# Altium schematic sheet DDR3L_Module.SchDoc
size A4; SheetNumber: 7; SheetTotal: 8
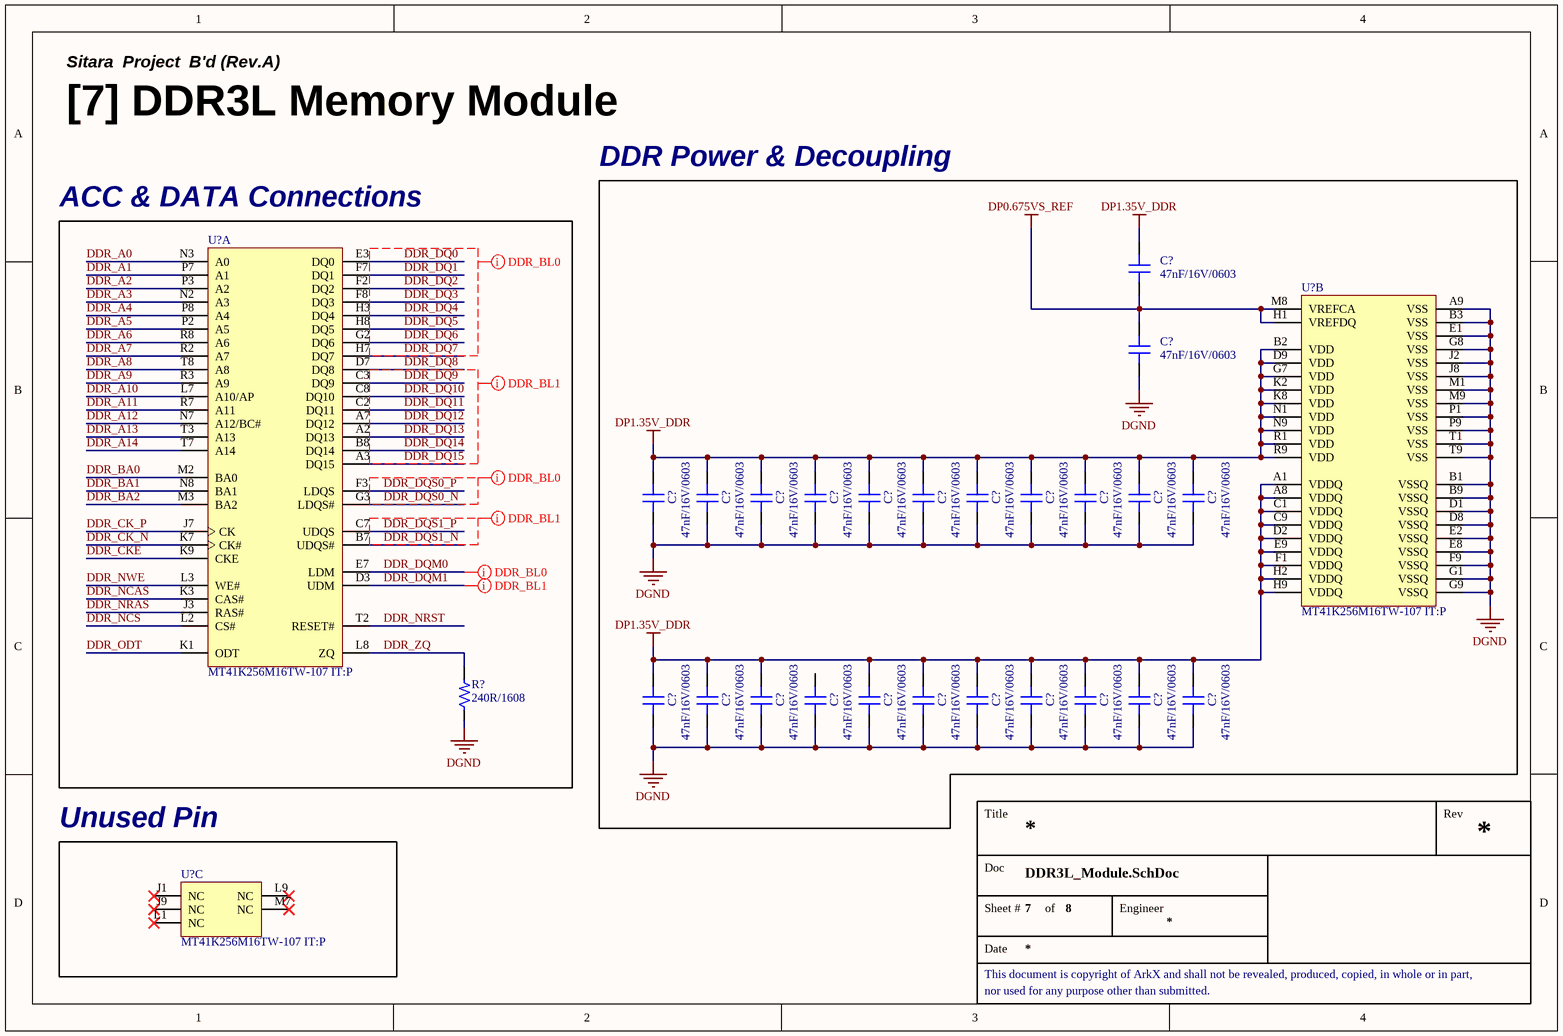
[diagram p0: DDR3L_Module.SchDoc]

## Parts
(Parts that share a designator on the sheet are numbered #1, #2 ... from top to bottom, then left to right.)
C?#1  47nF/16V/0603  [CAP 0603 (0201_INCH)]
C?#2  47nF/16V/0603  [CAP 0603 (0201_INCH)]
C?#3  47nF/16V/0603  [CAP 0603 (0201_INCH)]
C?#4  47nF/16V/0603  [CAP 0603 (0201_INCH)]
C?#5  47nF/16V/0603  [CAP 0603 (0201_INCH)]
C?#6  47nF/16V/0603  [CAP 0603 (0201_INCH)]
C?#7  47nF/16V/0603  [CAP 0603 (0201_INCH)]
C?#8  47nF/16V/0603  [CAP 0603 (0201_INCH)]
C?#9  47nF/16V/0603  [CAP 0603 (0201_INCH)]
C?#10  47nF/16V/0603  [CAP 0603 (0201_INCH)]
C?#11  47nF/16V/0603  [CAP 0603 (0201_INCH)]
C?#12  47nF/16V/0603  [CAP 0603 (0201_INCH)]
C?#13  47nF/16V/0603  [CAP 0603 (0201_INCH)]
C?#14  47nF/16V/0603  [CAP 0603 (0201_INCH)]
C?#15  47nF/16V/0603  [CAP 0603 (0201_INCH)]
C?#16  47nF/16V/0603  [CAP 0603 (0201_INCH)]
C?#17  47nF/16V/0603  [CAP 0603 (0201_INCH)]
C?#18  47nF/16V/0603  [CAP 0603 (0201_INCH)]
C?#19  47nF/16V/0603  [CAP 0603 (0201_INCH)]
C?#20  47nF/16V/0603  [CAP 0603 (0201_INCH)]
C?#21  47nF/16V/0603  [CAP 0603 (0201_INCH)]
C?#22  47nF/16V/0603  [CAP 0603 (0201_INCH)]
C?#23  47nF/16V/0603  [CAP 0603 (0201_INCH)]
C?#24  47nF/16V/0603  [CAP 0603 (0201_INCH)]
R?  240R/1608  [RES 1608 (0603_inch)]
U?#1  MT41K256M16TW-107 IT:P  [IC_MEM_DDR3L_MT41K256M16TW-107 IT:P]  (part A of 3)
U?#2  MT41K256M16TW-107 IT:P  [IC_MEM_DDR3L_MT41K256M16TW-107 IT:P]  (part B of 3)
U?#3  MT41K256M16TW-107 IT:P  [IC_MEM_DDR3L_MT41K256M16TW-107 IT:P]  (part C of 3)

## Blocks framed on the sheet
DDR Power & Decoupling: C?#1-C?#24 U?#2
ACC & DATA Connections: R? U?#1
Unused Pin: U?#3

## Nets
DGND: C?#2.1 C?#3.1 C?#4.1 C?#5.1 C?#6.1 C?#7.1 C?#8.1 C?#9.1 C?#10.1 C?#11.1 C?#12.1 C?#13.1 C?#14.1 C?#15.1 C?#16.1 C?#17.1 C?#18.1 C?#19.1 C?#20.1 C?#21.1 C?#22.1 C?#23.1 C?#24.1 R?.1 U?#2.A9(VSS) U?#2.B1(VSSQ) U?#2.B3(VSS) U?#2.B9(VSSQ) U?#2.D1(VSSQ) U?#2.D8(VSSQ) U?#2.E1(VSS) U?#2.E2(VSSQ) U?#2.E8(VSSQ) U?#2.F9(VSSQ) U?#2.G1(VSSQ) U?#2.G8(VSS) U?#2.G9(VSSQ) U?#2.J2(VSS) U?#2.J8(VSS) U?#2.M1(VSS) U?#2.M9(VSS) U?#2.P1(VSS) U?#2.P9(VSS) U?#2.T1(VSS) U?#2.T9(VSS)
DP0.675VS_REF: C?#1.1 C?#2.2 U?#2.H1(VREFDQ) U?#2.M8(VREFCA)
DP1.35V_DDR: C?#1.2 C?#3.2 C?#4.2 C?#5.2 C?#6.2 C?#7.2 C?#8.2 C?#9.2 C?#10.2 C?#11.2 C?#12.2 C?#13.2 C?#14.2 C?#15.2 C?#16.2 C?#18.2 C?#19.2 C?#20.2 C?#21.2 C?#22.2 C?#23.2 C?#24.2 U?#2.A1(VDDQ) U?#2.A8(VDDQ) U?#2.B2(VDD) U?#2.C1(VDDQ) U?#2.C9(VDDQ) U?#2.D2(VDDQ) U?#2.D9(VDD) U?#2.E9(VDDQ) U?#2.F1(VDDQ) U?#2.G7(VDD) U?#2.H2(VDDQ) U?#2.H9(VDDQ) U?#2.K2(VDD) U?#2.K8(VDD) U?#2.N1(VDD) U?#2.N9(VDD) U?#2.R1(VDD) U?#2.R9(VDD)
DDR_A0: U?#1.N3(A0)
DDR_A1: U?#1.P7(A1)
DDR_A2: U?#1.P3(A2)
DDR_A3: U?#1.N2(A3)
DDR_A4: U?#1.P8(A4)
DDR_A5: U?#1.P2(A5)
DDR_A6: U?#1.R8(A6)
DDR_A7: U?#1.R2(A7)
DDR_A8: U?#1.T8(A8)
DDR_A9: U?#1.R3(A9)
DDR_A10: U?#1.L7(A10/AP)
DDR_A11: U?#1.R7(A11)
DDR_A12: U?#1.N7(A12/BC#)
DDR_A13: U?#1.T3(A13)
DDR_A14: U?#1.T7(A14)
DDR_BA0: U?#1.M2(BA0)
DDR_BA1: U?#1.N8(BA1)
DDR_BA2: U?#1.M3(BA2)
DDR_CK_N: U?#1.K7(CK#)
DDR_CK_P: U?#1.J7(CK)
DDR_CKE: U?#1.K9(CKE)
DDR_DQ0: U?#1.E3(DQ0)
DDR_DQ1: U?#1.F7(DQ1)
DDR_DQ2: U?#1.F2(DQ2)
DDR_DQ3: U?#1.F8(DQ3)
DDR_DQ4: U?#1.H3(DQ4)
DDR_DQ5: U?#1.H8(DQ5)
DDR_DQ6: U?#1.G2(DQ6)
DDR_DQ7: U?#1.H7(DQ7)
DDR_DQ8: U?#1.D7(DQ8)
DDR_DQ9: U?#1.C3(DQ9)
DDR_DQ10: U?#1.C8(DQ10)
DDR_DQ11: U?#1.C2(DQ11)
DDR_DQ12: U?#1.A7(DQ12)
DDR_DQ13: U?#1.A2(DQ13)
DDR_DQ14: U?#1.B8(DQ14)
DDR_DQ15: U?#1.A3(DQ15)
DDR_DQM0: U?#1.E7(LDM)
DDR_DQM1: U?#1.D3(UDM)
DDR_DQS0_N: U?#1.G3(LDQS#)
DDR_DQS0_P: U?#1.F3(LDQS)
DDR_DQS1_N: U?#1.B7(UDQS#)
DDR_DQS1_P: U?#1.C7(UDQS)
DDR_NCAS: U?#1.K3(CAS#)
DDR_NCS: U?#1.L2(CS#)
DDR_NRAS: U?#1.J3(RAS#)
DDR_NRST: U?#1.T2(RESET#)
DDR_NWE: U?#1.L3(WE#)
DDR_ODT: U?#1.K1(ODT)
DDR_ZQ: R?.2 U?#1.L8(ZQ)

Not connected (* = marked no-connect by the designer): C?#17 2; U?#3 J1(NC)* J9(NC)* L1(NC)* L9(NC)* M7(NC)*

## Layout directives
rule Matched Net Lengths [Delay Tolerance = 10ps]; net class DDR_BL0: DDR_DQ0, DDR_DQ1, DDR_DQ2, DDR_DQ3, DDR_DQ4, DDR_DQ5, DDR_DQ6, DDR_DQ7, DDR_DQM0, DDR_DQS0_N, DDR_DQS0_P
rule Matched Net Lengths [Delay Tolerance = 10ps]; net class DDR_BL1: DDR_DQ8, DDR_DQ9, DDR_DQ10, DDR_DQ11, DDR_DQ12, DDR_DQ13, DDR_DQ14, DDR_DQ15, DDR_DQM1, DDR_DQS1_N, DDR_DQS1_P

## Notes on the sheet
- Sitara  Project  B'd (Rev.A)
- [7] DDR3L Memory Module
- Title
- Rev
- Doc
- Sheet #
- of
- Engineer
- This document is copyright of ArkX and shall not be revealed, produced, copied, in whole or in part,
- Date
- nor used for any purpose other than submitted.

## Library data of the parts
C?#1-C?#24 = CAP_47nF/16V/0603: 16V 47nF X5R ±10% 0201 Multilayer Ceramic Capacitors MLCC - SMD/SMT ROHS; JLCPCB Part Type: Extended Part; LCSC Part #: C88917
R? = RES_240R/1608/0.1W: Value: 240R; Power Rating: 0.1W; Precision: 1%; Size: 1608; LCSC Part #: C23350; JLCPCB Part Type: Basic Part
U?#1-U?#3 = IC_MEM_DDR3L_MT41K256M16TW-107 IT:P: SDRAM - DDR3L Memory IC 4Gbit Parallel 933 MHz 20 ns 96-FBGA (8x14); JLCPCB Part Type: Extended Part; LCSC Part #: C367428